# EAGLE design kicker (EAGLE 4.16)
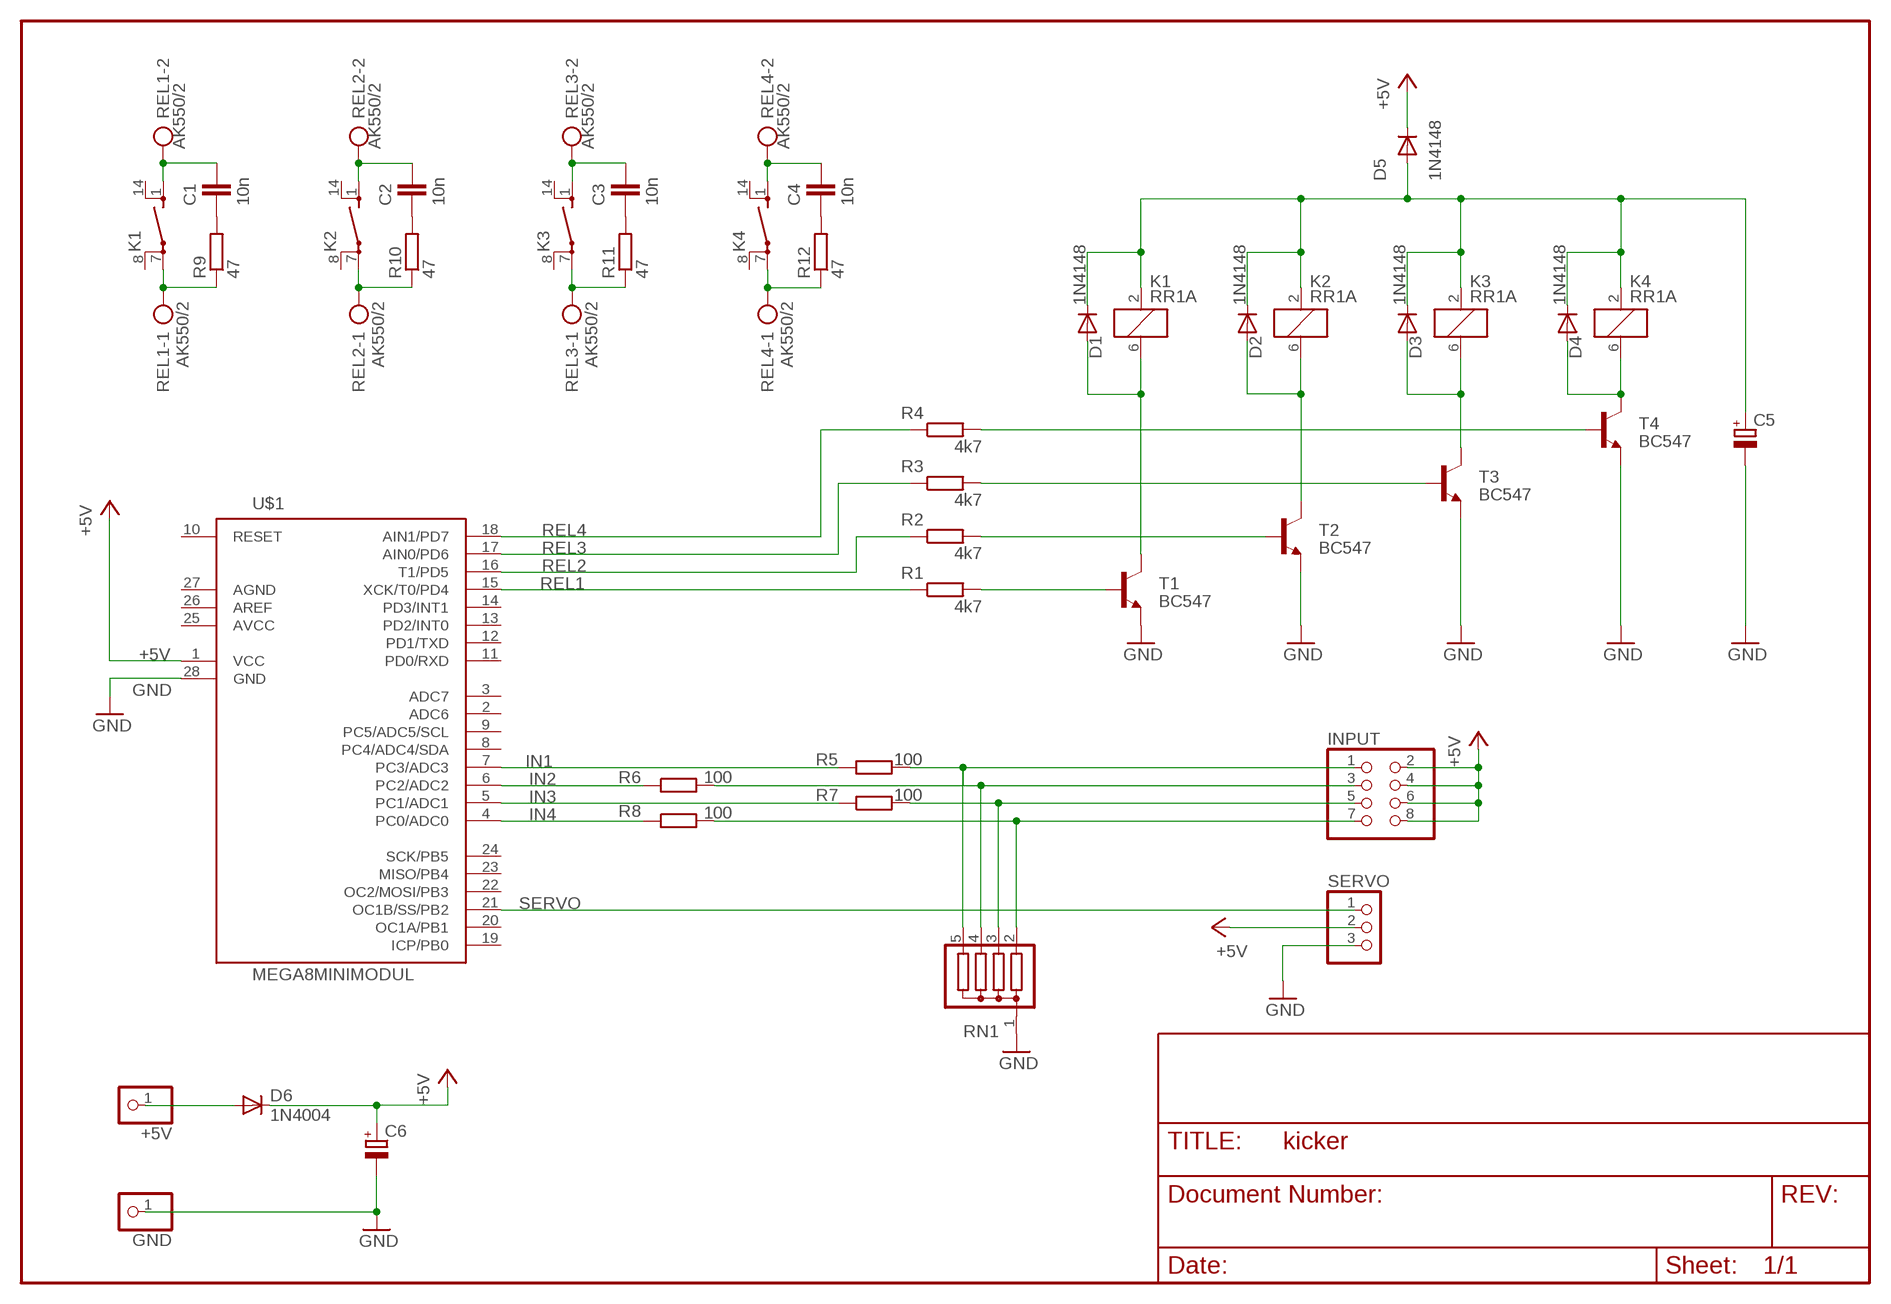
[diagram p0: schematic, sheet 1]

## Parts
+5V  PINHD-1X1  [1X01]
C1  10n  C-EU050-025X075  [C050-025X075]
C2  10n  C-EU050-025X075  [C050-025X075]
C3  10n  C-EU050-025X075  [C050-025X075]
C4  10n  C-EU050-025X075  [C050-025X075]
C5  CPOL-EUE1.8-4  [E1,8-4]
C6  CPOL-EUE2.5-5  [E2,5-5]
D1  1N4148  [DO35-10]
D2  1N4148  [DO35-10]
D3  1N4148  [DO35-10]
D4  1N4148  [DO35-10]
D5  1N4148  [DO35-10]
D6  1N4004  [DO41-10]
GND  PINHD-1X1  [1X01]
INPUT  PINHD-2X4  [2X04]
K1  RR1A  [RR1A]
K2  RR1A  [RR1A]
K3  RR1A  [RR1A]
K4  RR1A  [RR1A]
R1  4k7  R-EU_0207/2V  [0207/2V]
R2  4k7  R-EU_0207/2V  [0207/2V]
R3  4k7  R-EU_0207/2V  [0207/2V]
R4  4k7  R-EU_0207/2V  [0207/2V]
R5  100  R-EU_0204/5  [0204/5]
R6  100  R-EU_0204/5  [0204/5]
R7  100  R-EU_0204/5  [0204/5]
R8  100  R-EU_0204/5  [0204/5]
R9  47  R-EU_0207/7  [0207/7]
R10  47  R-EU_0207/7  [0207/7]
R11  47  R-EU_0207/7  [0207/7]
R12  47  R-EU_0207/7  [0207/7]
REL1  AK550/2  [AK550/2]
REL2  AK550/2  [AK550/2]
REL3  AK550/2  [AK550/2]
REL4  AK550/2  [AK550/2]
RN1  G04R  [SIL5]
SERVO  PINHD-1X3  [1X03]
T1  BC547  [TO92]
T2  BC547  [TO92]
T3  BC547  [TO92]
T4  BC547  [TO92]
U$1  MEGA8MINIMODUL  [MEGA8MM]

## Nets
+5V: C6.+ D5.C D6.C INPUT.2 INPUT.4 INPUT.6 INPUT.8 SERVO.2 U$1.1(VCC)
GND: C5.- C6.- GND.1 RN1.1 SERVO.3 T1.1(E) T2.1(E) T3.1(E) T4.1(E) U$1.28(GND)
IN1: R5.1 U$1.7(PC3/ADC3)
IN2: R6.1 U$1.6(PC2/ADC2)
IN3: R7.1 U$1.5(PC1/ADC1)
IN4: R8.1 U$1.4(PC0/ADC0)
N$1: R1.2 T1.2(B)
N$2: R2.2 T2.2(B)
N$3: R3.2 T3.2(B)
N$4: R4.2 T4.2(B)
N$5: D1.A K1.6 T1.3(C)
N$6: D2.A K2.6 T2.3(C)
N$7: D4.A K4.6 T4.3(C)
N$8: INPUT.1 R5.2 RN1.5
N$9: INPUT.3 R6.2 RN1.4
N$10: INPUT.5 R7.2 RN1.3
N$11: D3.A K3.6 T3.3(C)
N$12: INPUT.7 R8.2 RN1.2
N$13: C5.+ D1.C D2.C D3.C D4.C D5.A K1.2 K2.2 K3.2 K4.2
N$14: C1.2 R9.2
N$15: C2.2 R10.2
N$16: C3.2 R11.2
N$17: C4.2 R12.2
N$18: C3.1 K3.1(2:S) REL3.2
N$19: C2.1 K2.1(2:S) REL2.2
N$20: K3.7(2:P) R11.1 REL3.1
N$21: K2.7(2:P) R10.1 REL2.1
N$22: K1.7(2:P) R9.1 REL1.1
N$23: C1.1 K1.1(2:S) REL1.2
N$24: C4.1 K4.1(2:S) REL4.2
N$25: K4.7(2:P) R12.1 REL4.1
REL1: R1.1 U$1.15(XCK/T0/PD4)
REL2: R2.1 U$1.16(T1/PD5)
REL3: R3.1 U$1.17(AIN0/PD6)
REL4: R4.1 U$1.18(AIN1/PD7)
SERVO: SERVO.1 U$1.21(OC1B/SS/PB2)
VIN: +5V.1 D6.A
Unconnected: K1.8(2:P) K1.14(2:S) K2.8(2:P) K2.14(2:S) K3.8(2:P) K3.14(2:S) K4.8(2:P) K4.14(2:S) U$1.2(ADC6) U$1.3(ADC7) U$1.8(PC4/ADC4/SDA) U$1.9(PC5/ADC5/SCL) U$1.10(RESET) U$1.11(PD0/RXD) U$1.12(PD1/TXD) U$1.13(PD2/INT0) U$1.14(PD3/INT1) U$1.19(ICP/PB0) U$1.20(OC1A/PB1) U$1.22(OC2/MOSI/PB3) U$1.23(MISO/PB4) U$1.24(SCK/PB5)

## Power pins joined to a net without a drawn wire
AGND: U$1.27(AGND)
AREF: U$1.26(AREF)
AVCC: U$1.25(AVCC)

## Library data of the parts
+5V GND = pinhead:PINHD-1X1: PIN HEADER
C1-C4 = rcl:C-EU: CAPACITOR, European symbol
C5 C6 = rcl:CPOL-EU: POLARIZED CAPACITOR, European symbol
D1-D5 = diode:1N4148: DIODE high speed (Philips)
D6 = diode:1N4004: DIODE general purpose rectifier, 1 A
INPUT = pinhead:PINHD-2X4: PIN HEADER
K1-K4 = relay:RR1A: RELAY reed, polarity, 1 x norm. open with shield
R1-R12 = rcl:R-EU_: RESISTOR, European symbol
REL1-REL4 = con-ptr500:AK550/2: CONNECTOR
RN1 = resistor-sil:G04R: SIL RESISTOR
SERVO = pinhead:PINHD-1X3: PIN HEADER
T1-T4 = transistor:BC547: NPN TRANSISTOR
U$1 = Modules:MEGA8MINIMODUL: Mega8 Mini Modul RS232 und RS485 Embedit Mikrocontrollertechnik

## Board
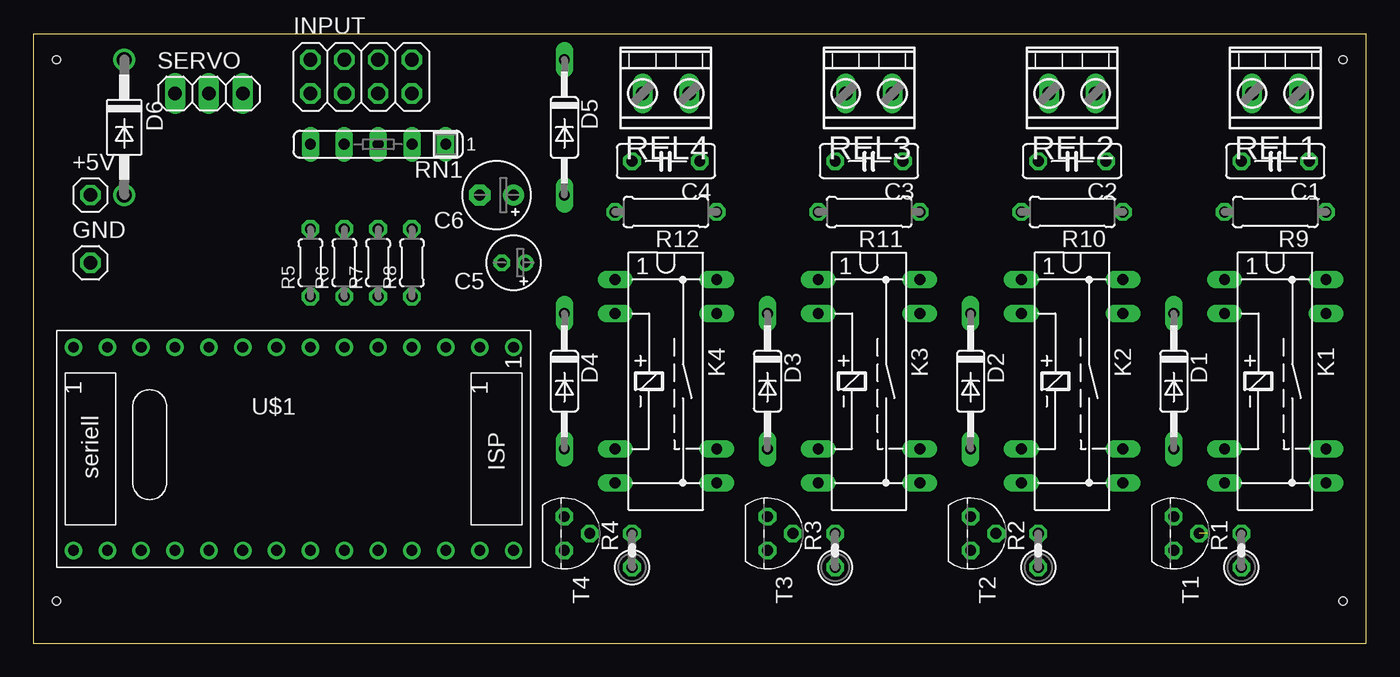
[diagram p1: board, top side]
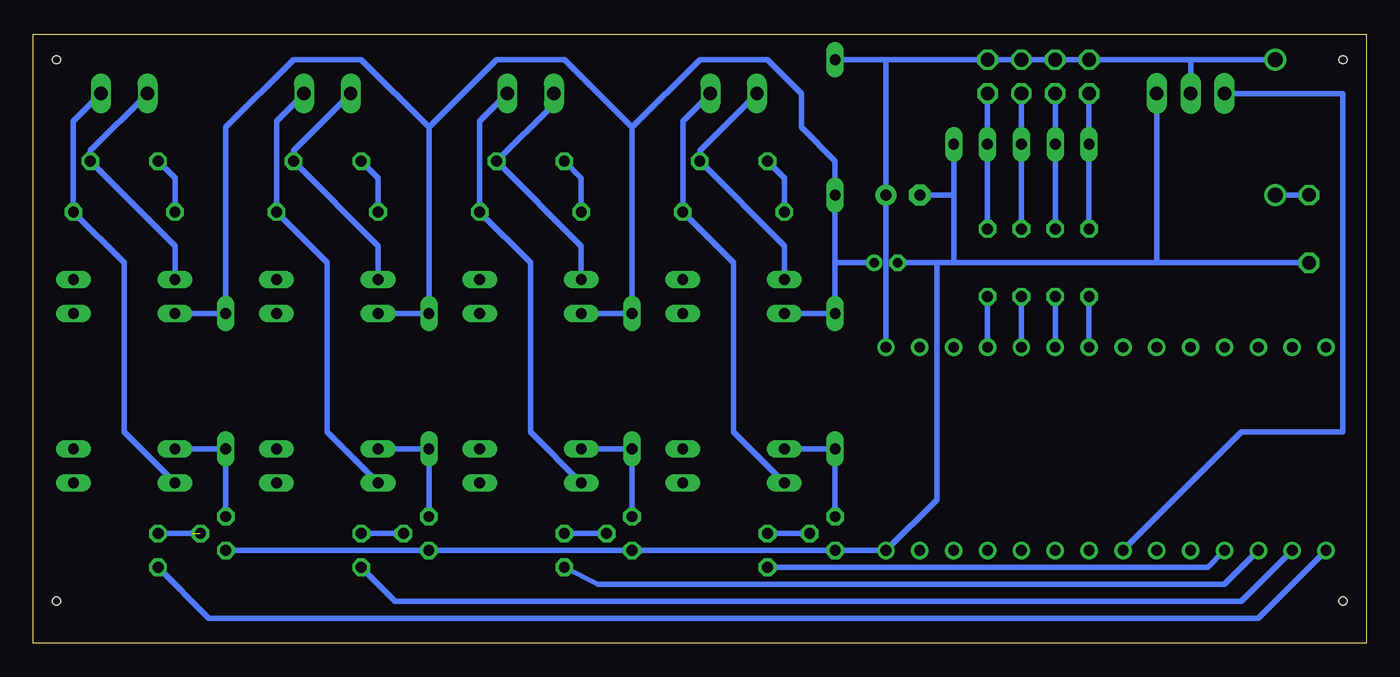
[diagram p2: board, bottom side, seen from below]

Size 100 x 45.71 mm. Coordinates in mm from the lower left corner, seen from the top.
Outline: 0,0 100,0 100,45.71 0,45.71 0,0
Copper layers (1*16): Top 0.035mm / dielectric 1.5mm / Bottom 0.035mm
Design rules "default": minimum track width 10mil, minimum drill 24mil, track to track 8mil, track to pad 8mil, pad to pad 8mil, via to via 8mil, smd to smd 8mil, copper to edge 40mil, drill to drill 8mil, minimum pad ring 10mil, minimum via ring 8mil, stop-mask expansion 4mil, vias tented up to drill 0mil, thermal gap 10mil
Holes 0.6 mm at 1.74,3.17 98.26,3.17 98.26,43.81 1.74,43.81

### Footprints (pad centres in the part's own frame; a part is rotated, then mirrored left to right if it is on the bottom)
1X01 = drill 1.016 octagon: 1 0,0
C050-025X075 = drill 0.813 octagon: 1 -2.54,0; 2 2.54,0
E1,8-4 = drill 0.711 pad 1.168 round: + -0.889,0 | drill 0.711 pad 1.168 octagon: - 0.889,0
E2,5-5 = drill 0.813 pad 1.6 round: + -1.27,0 | drill 0.813 pad 1.6 octagon: - 1.27,0
DO35-10 = drill 0.813 long: A 5.08,0; C -5.08,0
DO41-10 = drill 1.118 round: A 5.08,0; C -5.08,0
2X04 = drill 1.016 octagon: 1 -3.81,-1.27; 2 -3.81,1.27; 3 -1.27,-1.27; 4 -1.27,1.27; 5 1.27,-1.27; 6 1.27,1.27; 7 3.81,-1.27; 8 3.81,1.27
RR1A = drill 0.813 long: 1 -7.62,-3.81; 2 -5.08,-3.81; 6 5.08,-3.81; 7 7.62,-3.81; 8 7.62,3.81; 9 5.08,3.81; 13 -5.08,3.81; 14 -7.62,3.81
0207/2V = drill 0.813 octagon: 1 -1.27,0; 2 1.27,0
0204/5 = drill 0.813 octagon: 1 -2.54,0; 2 2.54,0
0207/7 = drill 0.813 octagon: 1 -3.81,0; 2 3.81,0
AK550/2 = drill 1 pad 1.5 long: 1 -1.75,0; 2 1.75,0
SIL5 = drill 0.813 long: 1 -5.08,0; 2 -2.54,0; 3 0,0; 4 2.54,0; 5 5.08,0
1X03 = drill 1.016 long: 1 -2.54,0; 2 0,0; 3 2.54,0
TO92 = drill 0.813 octagon: 1 1.27,0; 2 0,1.905; 3 -1.27,0
MEGA8MM = drill 0.8 round: 1 -7.62,16.51; 2 -7.62,13.97; 3 -7.62,11.43; 4 -7.62,8.89; 5 -7.62,6.35; 6 -7.62,3.81; 7 -7.62,1.27; 8 -7.62,-1.27; 9 -7.62,-3.81; 10 -7.62,-6.35; 11 -7.62,-8.89; 12 -7.62,-11.43; 13 -7.62,-13.97; 14 -7.62,-16.51; 15 7.62,-16.51; 16 7.62,-13.97; 17 7.62,-11.43; 18 7.62,-8.89; 19 7.62,-6.35; 20 7.62,-3.81; 21 7.62,-1.27; 22 7.62,1.27; 23 7.62,3.81; 24 7.62,6.35; 25 7.62,8.89; 26 7.62,11.43; 27 7.62,13.97; 28 7.62,16.51

### Placement (x,y rotation side)
+5V  4.28,33.65 0 top
C1  93.18,36.19 180 top
C2  77.94,36.19 180 top
C3  62.7,36.19 180 top
C4  47.46,36.19 180 top
C5  36.03,28.57 180 top
C6  34.76,33.65 180 top
D1  85.56,19.68 270 top
D2  70.32,19.68 270 top
D3  55.08,19.68 270 top
D4  39.84,19.68 270 top
D5  39.84,38.73 270 top
D6  6.82,38.73 270 top
GND  4.28,28.57 0 top
INPUT  24.6,42.54 0 top
K1  93.18,19.68 270 top
K2  77.94,19.68 270 top
K3  62.7,19.68 270 top
K4  47.46,19.68 270 top
R1  90.64,6.98 90 top
R2  75.4,6.98 90 top
R3  60.16,6.98 90 top
R4  44.92,6.98 90 top
R5  20.79,28.57 90 top
R6  23.33,28.57 90 top
R7  25.87,28.57 90 top
R8  28.41,28.57 90 top
R9  93.18,32.38 180 top
R10  77.94,32.38 180 top
R11  62.7,32.38 180 top
R12  47.46,32.38 180 top
REL1  93.18,41.27 180 top
REL2  77.94,41.27 180 top
REL3  62.7,41.27 180 top
REL4  47.46,41.27 180 top
RN1  25.87,37.46 180 top
SERVO  13.17,41.27 0 top
T1  85.56,8.25 270 top
T2  70.32,8.25 270 top
T3  55.08,8.25 270 top
T4  39.84,8.25 270 top
U$1  19.52,14.6 270 top

### Tracks (layer width: path | path; a pad name or v marks a point on that pad's centre or on a via)
+5V
  Bottom 0.406: D6.C 13.17,43.81 | 13.17,43.81 INPUT.2 INPUT.4 INPUT.6 INPUT.8 36.03,43.81 | 13.17,43.81 SERVO.2 | 36.03,43.81 D5.C | 36.03,43.81 C6.+ U$1.1
GND
  Bottom 0.406: T1.1 T2.1 T3.1 T4.1 U$1.28 32.22,10.79 32.22,28.57 | 30.95,28.57 30.95,33.65 | 30.95,33.65 RN1.1 | 30.95,28.57 32.22,28.57 | 32.22,28.57 C5.- | GND.1 15.71,28.57 | 15.71,28.57 SERVO.3 | 15.71,28.57 30.95,28.57 | 30.95,33.65 C6.-
IN1
  Bottom 0.406: R5.1 U$1.7
IN2
  Bottom 0.406: R6.1 U$1.6
IN3
  Bottom 0.406: R7.1 U$1.5
IN4
  Bottom 0.406: R8.1 U$1.4
N$1  (1 unrouted)
  Bottom 0.406: 88.1,8.25 R1.2
N$2
  Bottom 0.406: T2.2 R2.2
N$3
  Bottom 0.406: T3.2 R3.2
N$4
  Bottom 0.406: T4.2 R4.2
N$5
  Bottom 0.406: K1.6 D1.A T1.3
N$6
  Bottom 0.406: K2.6 D2.A T2.3
N$7
  Bottom 0.406: K4.6 D4.A T4.3
N$8
  Bottom 0.406: R5.2 RN1.5 INPUT.1
N$9
  Bottom 0.406: INPUT.3 RN1.4 R6.2
N$10
  Bottom 0.406: R7.2 RN1.3 INPUT.5
N$11
  Bottom 0.406: K3.6 D3.A T3.3
N$12
  Bottom 0.406: R8.2 RN1.2 INPUT.7
N$13
  Bottom 0.406: K1.2 D1.C 85.56,38.73 80.48,43.81 75.4,43.81 70.32,38.73 | K2.2 D2.C 70.32,38.73 | 70.32,38.73 65.24,43.81 60.16,43.81 55.08,38.73 | K3.2 D3.C 55.08,38.73 | K4.2 D4.C 39.84,28.57 | 55.08,38.73 50,43.81 44.92,43.81 42.38,41.27 42.38,38.73 39.84,36.19 D5.A 39.84,28.57 | C5.+ 39.84,28.57
N$14
  Bottom 0.406: C1.2 89.37,34.92 R9.2
N$15
  Bottom 0.406: C2.2 74.13,34.92 R10.2
N$16
  Bottom 0.406: C3.2 58.89,34.92 R11.2
N$17
  Bottom 0.406: C4.2 43.65,34.92 R12.2
N$18
  Bottom 0.406: REL3.2 60.95,40.48 C3.1 58.89,29.84 K3.1
N$19
  Bottom 0.406: REL2.2 80.48,36.98 C2.1 74.13,29.84 K2.1
N$20
  Bottom 0.406: REL3.1 66.51,39.21 R11.1 62.7,28.57 62.7,15.87 K3.7
N$21
  Bottom 0.406: REL2.1 81.75,39.21 R10.1 77.94,28.57 77.94,15.87 K2.7
N$22
  Bottom 0.406: REL1.1 96.99,39.21 R9.1 93.18,28.57 93.18,15.87 K1.7
N$23
  Bottom 0.406: REL1.2 95.72,36.98 C1.1 89.37,29.84 K1.1
N$24
  Bottom 0.406: REL4.2 50,36.98 C4.1 43.65,29.84 K4.1
N$25
  Bottom 0.406: REL4.1 51.27,39.21 R12.1 47.46,28.57 47.46,15.87 K4.7
REL1
  Bottom 0.406: R1.1 86.83,1.9 8.09,1.9 U$1.15
REL2
  Bottom 0.406: R2.1 72.86,3.17 9.36,3.17 U$1.16
REL3
  Bottom 0.406: R3.1 57.62,4.44 10.63,4.44 U$1.17
REL4
  Bottom 0.406: R4.1 11.9,5.71 U$1.18
SERVO
  Bottom 0.406: U$1.21 9.36,15.87 1.74,15.87 1.74,41.27 SERVO.1
VIN
  Bottom 0.406: +5V.1 D6.A